# Altium schematic sheet AD_0_V1_01.SchDoc
size A2; Date: Date; CompanyName: HESSO; Engineer: Name; Address1: Route du Rawyl 47; Address2: 1950 Sion; Address3: Switzerland; DocumentNumber: 1; SheetNumber: 1; SheetTotal: 6; <: Nanchen Jean; ProjectName: Project Name
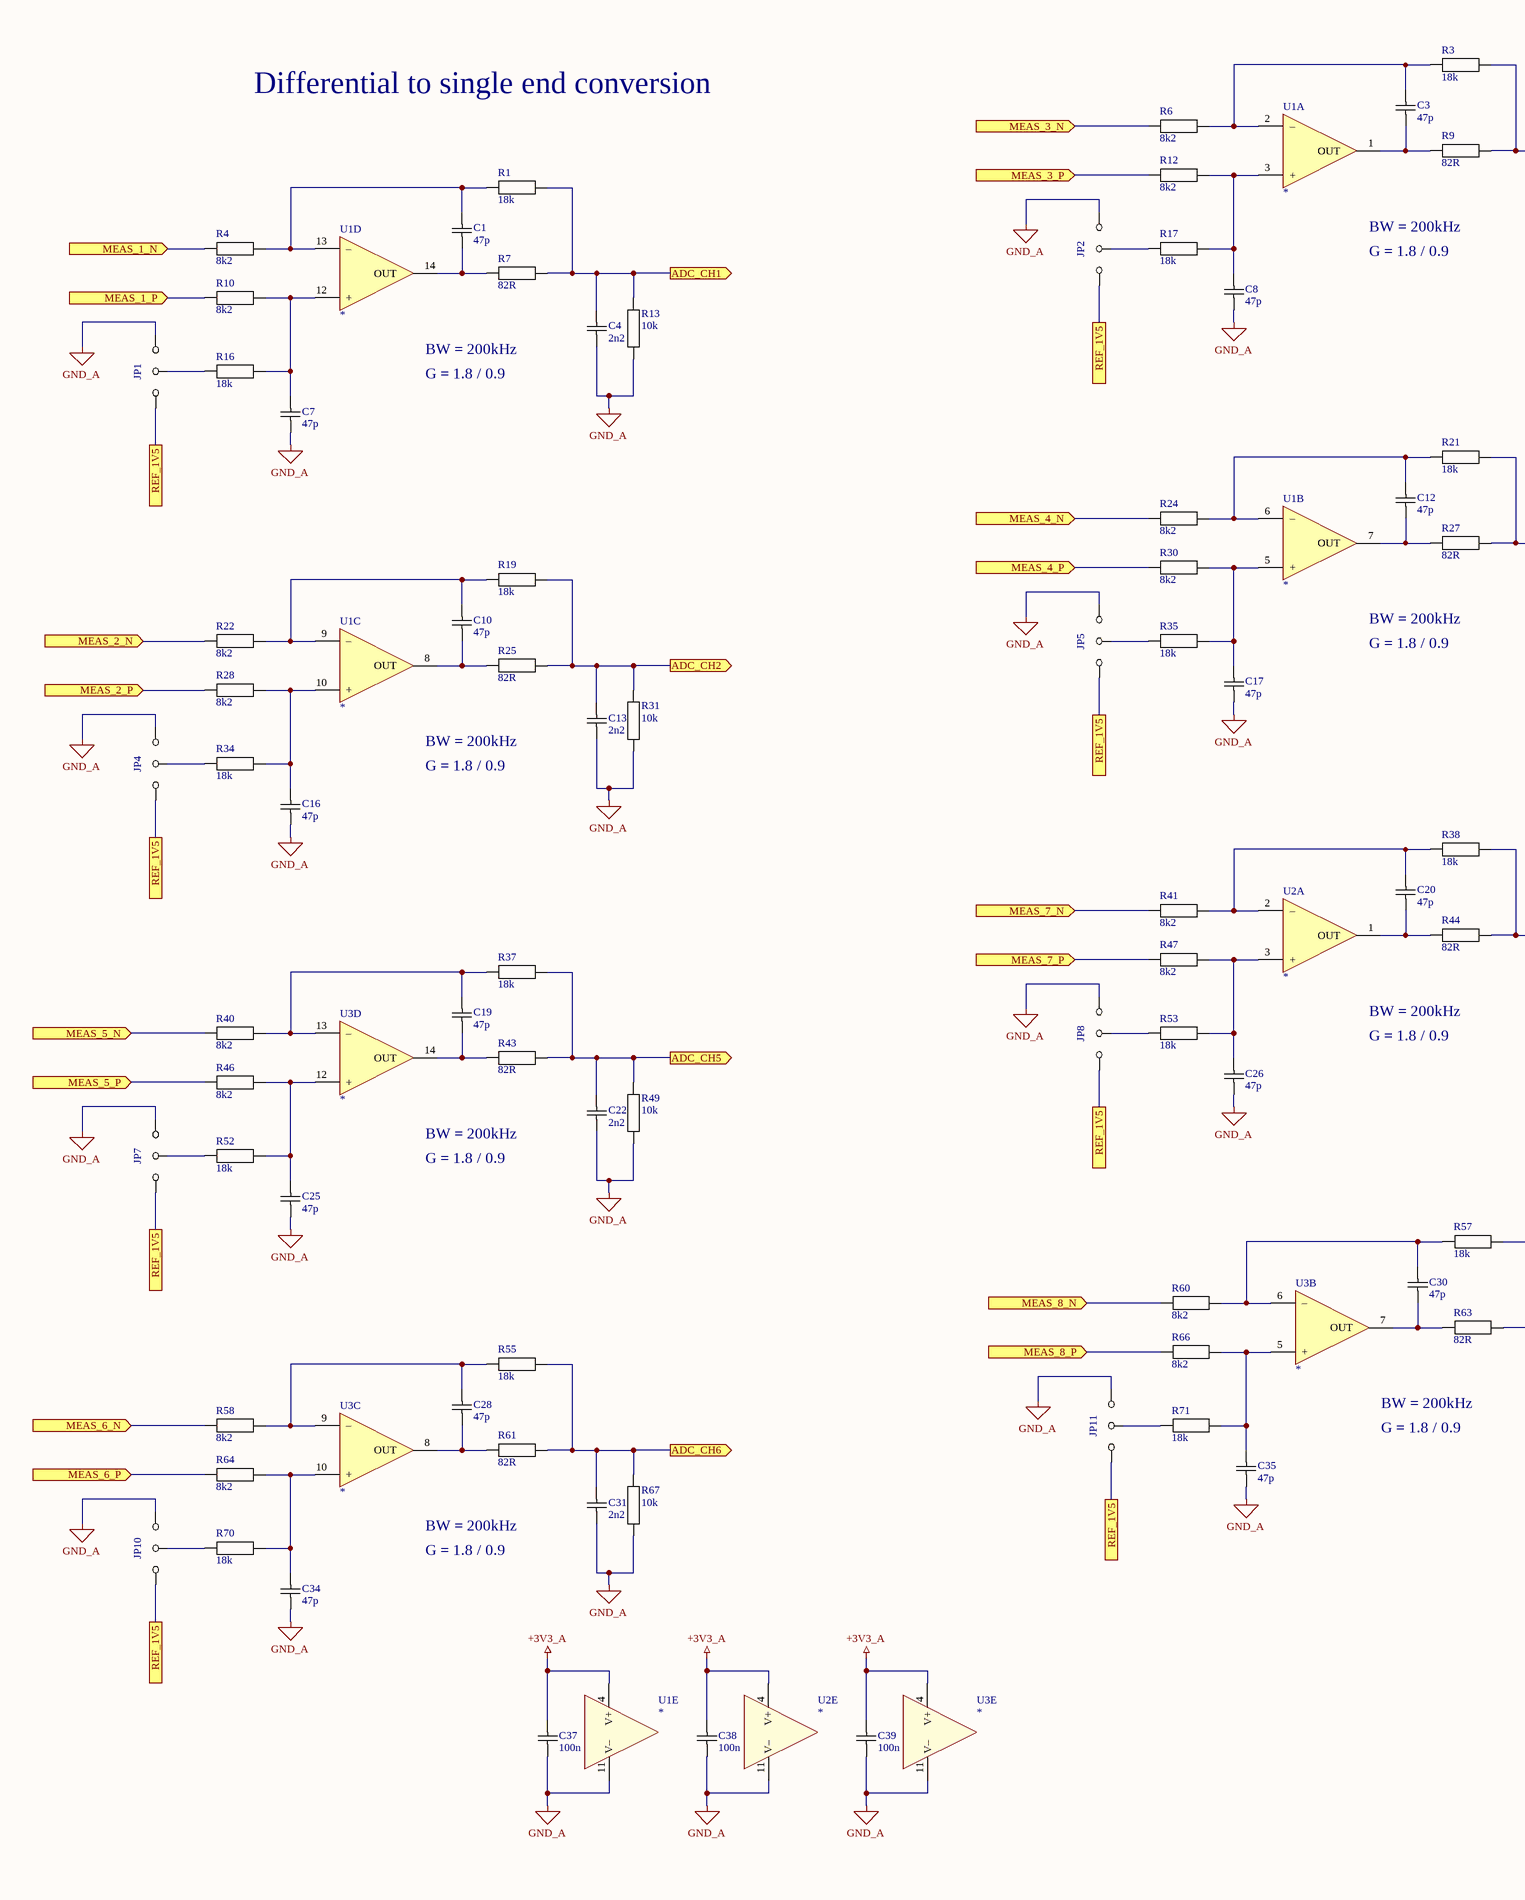
[diagram p0: AD_0_V1_01.SchDoc, left]
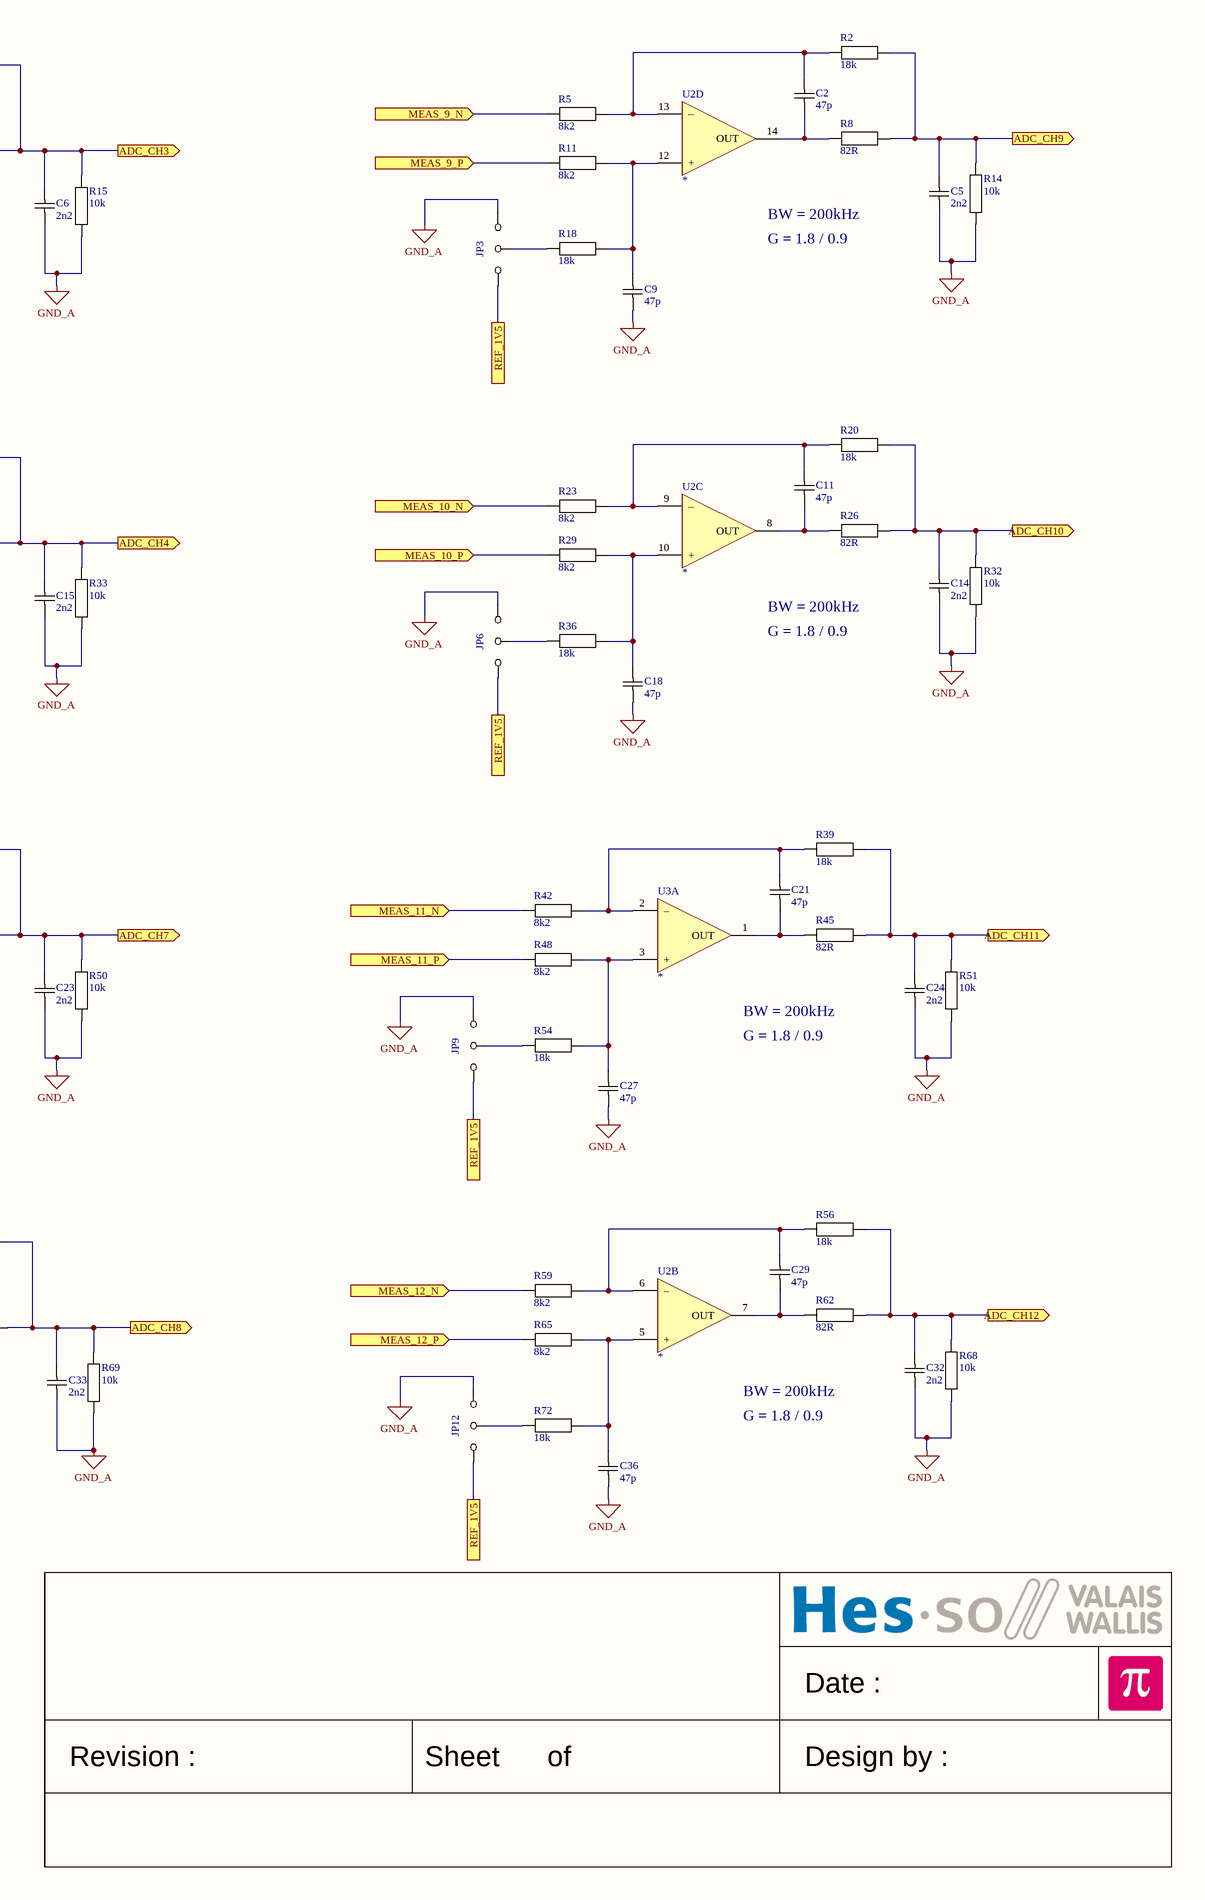
[diagram p1: AD_0_V1_01.SchDoc, right]

## Parts
C1  47p  [CAPACITOR 1608 REFLOW]
C2  47p  [CAPACITOR 1608 REFLOW]
C3  47p  [CAPACITOR 1608 REFLOW]
C4  2n2  [CAPACITOR 1608 REFLOW]
C5  2n2  [CAPACITOR 1608 REFLOW]
C6  2n2  [CAPACITOR 1608 REFLOW]
C7  47p  [CAPACITOR 1608 REFLOW]
C8  47p  [CAPACITOR 1608 REFLOW]
C9  47p  [CAPACITOR 1608 REFLOW]
C10  47p  [CAPACITOR 1608 REFLOW]
C11  47p  [CAPACITOR 1608 REFLOW]
C12  47p  [CAPACITOR 1608 REFLOW]
C13  2n2  [CAPACITOR 1608 REFLOW]
C14  2n2  [CAPACITOR 1608 REFLOW]
C15  2n2  [CAPACITOR 1608 REFLOW]
C16  47p  [CAPACITOR 1608 REFLOW]
C17  47p  [CAPACITOR 1608 REFLOW]
C18  47p  [CAPACITOR 1608 REFLOW]
C19  47p  [CAPACITOR 1608 REFLOW]
C20  47p  [CAPACITOR 1608 REFLOW]
C21  47p  [CAPACITOR 1608 REFLOW]
C22  2n2  [CAPACITOR 1608 REFLOW]
C23  2n2  [CAPACITOR 1608 REFLOW]
C24  2n2  [CAPACITOR 1608 REFLOW]
C25  47p  [CAPACITOR 1608 REFLOW]
C26  47p  [CAPACITOR 1608 REFLOW]
C27  47p  [CAPACITOR 1608 REFLOW]
C28  47p  [CAPACITOR 1608 REFLOW]
C29  47p  [CAPACITOR 1608 REFLOW]
C30  47p  [CAPACITOR 1608 REFLOW]
C31  2n2  [CAPACITOR 1608 REFLOW]
C32  2n2  [CAPACITOR 1608 REFLOW]
C33  2n2  [CAPACITOR 1608 REFLOW]
C34  47p  [CAPACITOR 1608 REFLOW]
C35  47p  [CAPACITOR 1608 REFLOW]
C36  47p  [CAPACITOR 1608 REFLOW]
C37  100n  [CAPACITOR 1608 REFLOW]
C38  100n  [CAPACITOR 1608 REFLOW]
C39  100n  [CAPACITOR 1608 REFLOW]
JP1  {Value}  [JUMPER3 SMD 1608]  (value not drawn)
JP2  {Value}  [JUMPER3 SMD 1608]  (value not drawn)
JP3  {Value}  [JUMPER3 SMD 1608]  (value not drawn)
JP4  {Value}  [JUMPER3 SMD 1608]  (value not drawn)
JP5  {Value}  [JUMPER3 SMD 1608]  (value not drawn)
JP6  {Value}  [JUMPER3 SMD 1608]  (value not drawn)
JP7  {Value}  [JUMPER3 SMD 1608]  (value not drawn)
JP8  {Value}  [JUMPER3 SMD 1608]  (value not drawn)
JP9  {Value}  [JUMPER3 SMD 1608]  (value not drawn)
JP10  {Value}  [JUMPER3 SMD 1608]  (value not drawn)
JP11  {Value}  [JUMPER3 SMD 1608]  (value not drawn)
JP12  {Value}  [JUMPER3 SMD 1608]  (value not drawn)
R1  18k  [RESISTOR 1608 REFLOW]
R2  18k  [RESISTOR 1608 REFLOW]
R3  18k  [RESISTOR 1608 REFLOW]
R4  8k2  [RESISTOR 1608 REFLOW]
R5  8k2  [RESISTOR 1608 REFLOW]
R6  8k2  [RESISTOR 1608 REFLOW]
R7  82R  [RESISTOR 1608 REFLOW]
R8  82R  [RESISTOR 1608 REFLOW]
R9  82R  [RESISTOR 1608 REFLOW]
R10  8k2  [RESISTOR 1608 REFLOW]
R11  8k2  [RESISTOR 1608 REFLOW]
R12  8k2  [RESISTOR 1608 REFLOW]
R13  10k  [RESISTOR 1608 REFLOW]
R14  10k  [RESISTOR 1608 REFLOW]
R15  10k  [RESISTOR 1608 REFLOW]
R16  18k  [RESISTOR 1608 REFLOW]
R17  18k  [RESISTOR 1608 REFLOW]
R18  18k  [RESISTOR 1608 REFLOW]
R19  18k  [RESISTOR 1608 REFLOW]
R20  18k  [RESISTOR 1608 REFLOW]
R21  18k  [RESISTOR 1608 REFLOW]
R22  8k2  [RESISTOR 1608 REFLOW]
R23  8k2  [RESISTOR 1608 REFLOW]
R24  8k2  [RESISTOR 1608 REFLOW]
R25  82R  [RESISTOR 1608 REFLOW]
R26  82R  [RESISTOR 1608 REFLOW]
R27  82R  [RESISTOR 1608 REFLOW]
R28  8k2  [RESISTOR 1608 REFLOW]
R29  8k2  [RESISTOR 1608 REFLOW]
R30  8k2  [RESISTOR 1608 REFLOW]
R31  10k  [RESISTOR 1608 REFLOW]
R32  10k  [RESISTOR 1608 REFLOW]
R33  10k  [RESISTOR 1608 REFLOW]
R34  18k  [RESISTOR 1608 REFLOW]
R35  18k  [RESISTOR 1608 REFLOW]
R36  18k  [RESISTOR 1608 REFLOW]
R37  18k  [RESISTOR 1608 REFLOW]
R38  18k  [RESISTOR 1608 REFLOW]
R39  18k  [RESISTOR 1608 REFLOW]
R40  8k2  [RESISTOR 1608 REFLOW]
R41  8k2  [RESISTOR 1608 REFLOW]
R42  8k2  [RESISTOR 1608 REFLOW]
R43  82R  [RESISTOR 1608 REFLOW]
R44  82R  [RESISTOR 1608 REFLOW]
R45  82R  [RESISTOR 1608 REFLOW]
R46  8k2  [RESISTOR 1608 REFLOW]
R47  8k2  [RESISTOR 1608 REFLOW]
R48  8k2  [RESISTOR 1608 REFLOW]
R49  10k  [RESISTOR 1608 REFLOW]
R50  10k  [RESISTOR 1608 REFLOW]
R51  10k  [RESISTOR 1608 REFLOW]
R52  18k  [RESISTOR 1608 REFLOW]
R53  18k  [RESISTOR 1608 REFLOW]
R54  18k  [RESISTOR 1608 REFLOW]
R55  18k  [RESISTOR 1608 REFLOW]
R56  18k  [RESISTOR 1608 REFLOW]
R57  18k  [RESISTOR 1608 REFLOW]
R58  8k2  [RESISTOR 1608 REFLOW]
R59  8k2  [RESISTOR 1608 REFLOW]
R60  8k2  [RESISTOR 1608 REFLOW]
R61  82R  [RESISTOR 1608 REFLOW]
R62  82R  [RESISTOR 1608 REFLOW]
R63  82R  [RESISTOR 1608 REFLOW]
R64  8k2  [RESISTOR 1608 REFLOW]
R65  8k2  [RESISTOR 1608 REFLOW]
R66  8k2  [RESISTOR 1608 REFLOW]
R67  10k  [RESISTOR 1608 REFLOW]
R68  10k  [RESISTOR 1608 REFLOW]
R69  10k  [RESISTOR 1608 REFLOW]
R70  18k  [RESISTOR 1608 REFLOW]
R71  18k  [RESISTOR 1608 REFLOW]
R72  18k  [RESISTOR 1608 REFLOW]
U1  *  [SO14 P1.27 C4.0X8.8 H1.75]  (parts A,B,C,D,E of 5)
U2  *  [SO14 P1.27 C4.0X8.8 H1.75]  (parts A,B,C,D,E of 5)
U3  *  [SO14 P1.27 C4.0X8.8 H1.75]  (parts A,B,C,D,E of 5)

## Ports
ADC_CH1 (out), ADC_CH2 (out), ADC_CH3 (out), ADC_CH4 (out), ADC_CH5 (out), ADC_CH6 (out), ADC_CH7 (out), ADC_CH8 (out), ADC_CH9 (out), ADC_CH10 (out), ADC_CH11 (out), ADC_CH12 (out), MEAS_1_N (in), MEAS_1_P (in), MEAS_2_N (in), MEAS_2_P (in), MEAS_3_N (in), MEAS_3_P (in), MEAS_4_N (in), MEAS_4_P (in), MEAS_5_N (in), MEAS_5_P (in), MEAS_6_N (in), MEAS_6_P (in), MEAS_7_N (in), MEAS_7_P (in), MEAS_8_N (in), MEAS_8_P (in), MEAS_9_N (in), MEAS_9_P (in), MEAS_10_N (in), MEAS_10_P (in), MEAS_11_N (in), MEAS_11_P (in), MEAS_12_N (in), MEAS_12_P (in), REF_1V5

## Nets
+3V3_A: C37.2 C38.2 C39.2 U1.4(V+) U2.4(V+) U3.4(V+)
GND_A: C4.1 C5.1 C6.1 C7.1 C8.1 C9.1 C13.1 C14.1 C15.1 C16.1 C17.1 C18.1 C22.1 C23.1 C24.1 C25.1 C26.1 C27.1 C31.1 C32.1 C33.1 C34.1 C35.1 C36.1 C37.1 C38.1 C39.1 JP1.3 JP2.3 JP3.3 JP4.3 JP5.3 JP6.3 JP7.3 JP8.3 JP9.3 JP10.3 JP11.3 JP12.3 R13.2 R14.2 R15.2 R31.2 R32.2 R33.2 R49.2 R50.2 R51.2 R67.2 R68.2 R69.2 U1.11(V–) U2.11(V–) U3.11(V–)
ADC_CH1: C4.2 R1.2 R7.2 R13.1 ; port ADC_CH1
ADC_CH2: C13.2 R19.2 R25.2 R31.1 ; port ADC_CH2
ADC_CH3: C6.2 R3.2 R9.2 R15.1 ; port ADC_CH3
ADC_CH4: C15.2 R21.2 R27.2 R33.1 ; port ADC_CH4
ADC_CH5: C22.2 R37.2 R43.2 R49.1 ; port ADC_CH5
ADC_CH6: C31.2 R55.2 R61.2 R67.1 ; port ADC_CH6
ADC_CH7: C23.2 R38.2 R44.2 R50.1 ; port ADC_CH7
ADC_CH8: C33.2 R57.2 R63.2 R69.1 ; port ADC_CH8
ADC_CH9: C5.2 R2.2 R8.2 R14.1 ; port ADC_CH9
ADC_CH10: C14.2 R20.2 R26.2 R32.1 ; port ADC_CH10
ADC_CH11: C24.2 R39.2 R45.2 R51.1 ; port ADC_CH11
ADC_CH12: C32.2 R56.2 R62.2 R68.1 ; port ADC_CH12
MEAS_1_N: R4.1 ; port MEAS_1_N
MEAS_1_P: R10.1 ; port MEAS_1_P
MEAS_2_N: R22.1 ; port MEAS_2_N
MEAS_2_P: R28.1 ; port MEAS_2_P
MEAS_3_N: R6.1 ; port MEAS_3_N
MEAS_3_P: R12.1 ; port MEAS_3_P
MEAS_4_N: R24.1 ; port MEAS_4_N
MEAS_4_P: R30.1 ; port MEAS_4_P
MEAS_5_N: R40.1 ; port MEAS_5_N
MEAS_5_P: R46.1 ; port MEAS_5_P
MEAS_6_N: R58.1 ; port MEAS_6_N
MEAS_6_P: R64.1 ; port MEAS_6_P
MEAS_7_N: R41.1 ; port MEAS_7_N
MEAS_7_P: R47.1 ; port MEAS_7_P
MEAS_8_N: R60.1 ; port MEAS_8_N
MEAS_8_P: R66.1 ; port MEAS_8_P
MEAS_9_N: R5.1 ; port MEAS_9_N
MEAS_9_P: R11.1 ; port MEAS_9_P
MEAS_10_N: R23.1 ; port MEAS_10_N
MEAS_10_P: R29.1 ; port MEAS_10_P
MEAS_11_N: R42.1 ; port MEAS_11_N
MEAS_11_P: R48.1 ; port MEAS_11_P
MEAS_12_N: R59.1 ; port MEAS_12_N
MEAS_12_P: R65.1 ; port MEAS_12_P
REF_1V5: JP1.1 JP2.1 JP3.1 JP4.1 JP5.1 JP6.1 JP7.1 JP8.1 JP9.1 JP10.1 JP11.1 JP12.1 ; port REF_1V5
NetC1_1: C1.1 R7.1 U1.14(OUT)
NetC1_2: C1.2 R1.1 R4.2 U1.13(–)
NetC2_1: C2.1 R8.1 U2.14(OUT)
NetC2_2: C2.2 R2.1 R5.2 U2.13(–)
NetC3_1: C3.1 R9.1 U1.1(OUT)
NetC3_2: C3.2 R3.1 R6.2 U1.2(–)
NetC7_2: C7.2 R10.2 R16.1 U1.12(+)
NetC8_2: C8.2 R12.2 R17.1 U1.3(+)
NetC9_2: C9.2 R11.2 R18.1 U2.12(+)
NetC10_1: C10.1 R25.1 U1.8(OUT)
NetC10_2: C10.2 R19.1 R22.2 U1.9(–)
NetC11_1: C11.1 R26.1 U2.8(OUT)
NetC11_2: C11.2 R20.1 R23.2 U2.9(–)
NetC12_1: C12.1 R27.1 U1.7(OUT)
NetC12_2: C12.2 R21.1 R24.2 U1.6(–)
NetC16_2: C16.2 R28.2 R34.1 U1.10(+)
NetC17_2: C17.2 R30.2 R35.1 U1.5(+)
NetC18_2: C18.2 R29.2 R36.1 U2.10(+)
NetC19_1: C19.1 R43.1 U3.14(OUT)
NetC19_2: C19.2 R37.1 R40.2 U3.13(–)
NetC20_1: C20.1 R44.1 U2.1(OUT)
NetC20_2: C20.2 R38.1 R41.2 U2.2(–)
NetC21_1: C21.1 R45.1 U3.1(OUT)
NetC21_2: C21.2 R39.1 R42.2 U3.2(–)
NetC25_2: C25.2 R46.2 R52.1 U3.12(+)
NetC26_2: C26.2 R47.2 R53.1 U2.3(+)
NetC27_2: C27.2 R48.2 R54.1 U3.3(+)
NetC28_1: C28.1 R61.1 U3.8(OUT)
NetC28_2: C28.2 R55.1 R58.2 U3.9(–)
NetC29_1: C29.1 R62.1 U2.7(OUT)
NetC29_2: C29.2 R56.1 R59.2 U2.6(–)
NetC30_1: C30.1 R63.1 U3.7(OUT)
NetC30_2: C30.2 R57.1 R60.2 U3.6(–)
NetC34_2: C34.2 R64.2 R70.1 U3.10(+)
NetC35_2: C35.2 R66.2 R71.1 U3.5(+)
NetC36_2: C36.2 R65.2 R72.1 U2.5(+)
NetJP1_2: JP1.2 R16.2
NetJP2_2: JP2.2 R17.2
NetJP3_2: JP3.2 R18.2
NetJP4_2: JP4.2 R34.2
NetJP5_2: JP5.2 R35.2
NetJP6_2: JP6.2 R36.2
NetJP7_2: JP7.2 R52.2
NetJP8_2: JP8.2 R53.2
NetJP9_2: JP9.2 R54.2
NetJP10_2: JP10.2 R70.2
NetJP11_2: JP11.2 R71.2
NetJP12_2: JP12.2 R72.2

## Notes on the sheet
- Differential to single end conversion
- BW = 200kHz
- G = 1.8 / 0.9
- Date :
- Revision :
- Sheet
- of
- Design by :

## Library data of the parts
C1-C39 = Capacitor: Capacitor X7R 10% 50V 1608(0603)
  C1-C3 C7-C12 C16-C21 C25-C30 C34-C36: Value: 47p
  C4-C6 C13-C15 C22-C24 C31-C33: Value: 2n2
  C37-C39: Value: 100n
JP1-JP12 = JUMPER 3 POS: Value: {Value}
R1-R72 = Resistor: Resistor 1% 50V 100mW 1608(0603)
  R1-R3 R16-R21 R34-R39 R52-R57 R70-R72: Value: 18k
  R4-R6 R10-R12 R22-R24 R28-R30 R40-R42 R46-R48 R58-R60 R64-R66: Value: 8k2
  R7-R9 R25-R27 R43-R45 R61-R63: Value: 82R
  R13-R15 R31-R33 R49-R51 R67-R69: Value: 10k
U1-U3 = OPA QUAD: Generic quad OPA 14 pins; Value: *